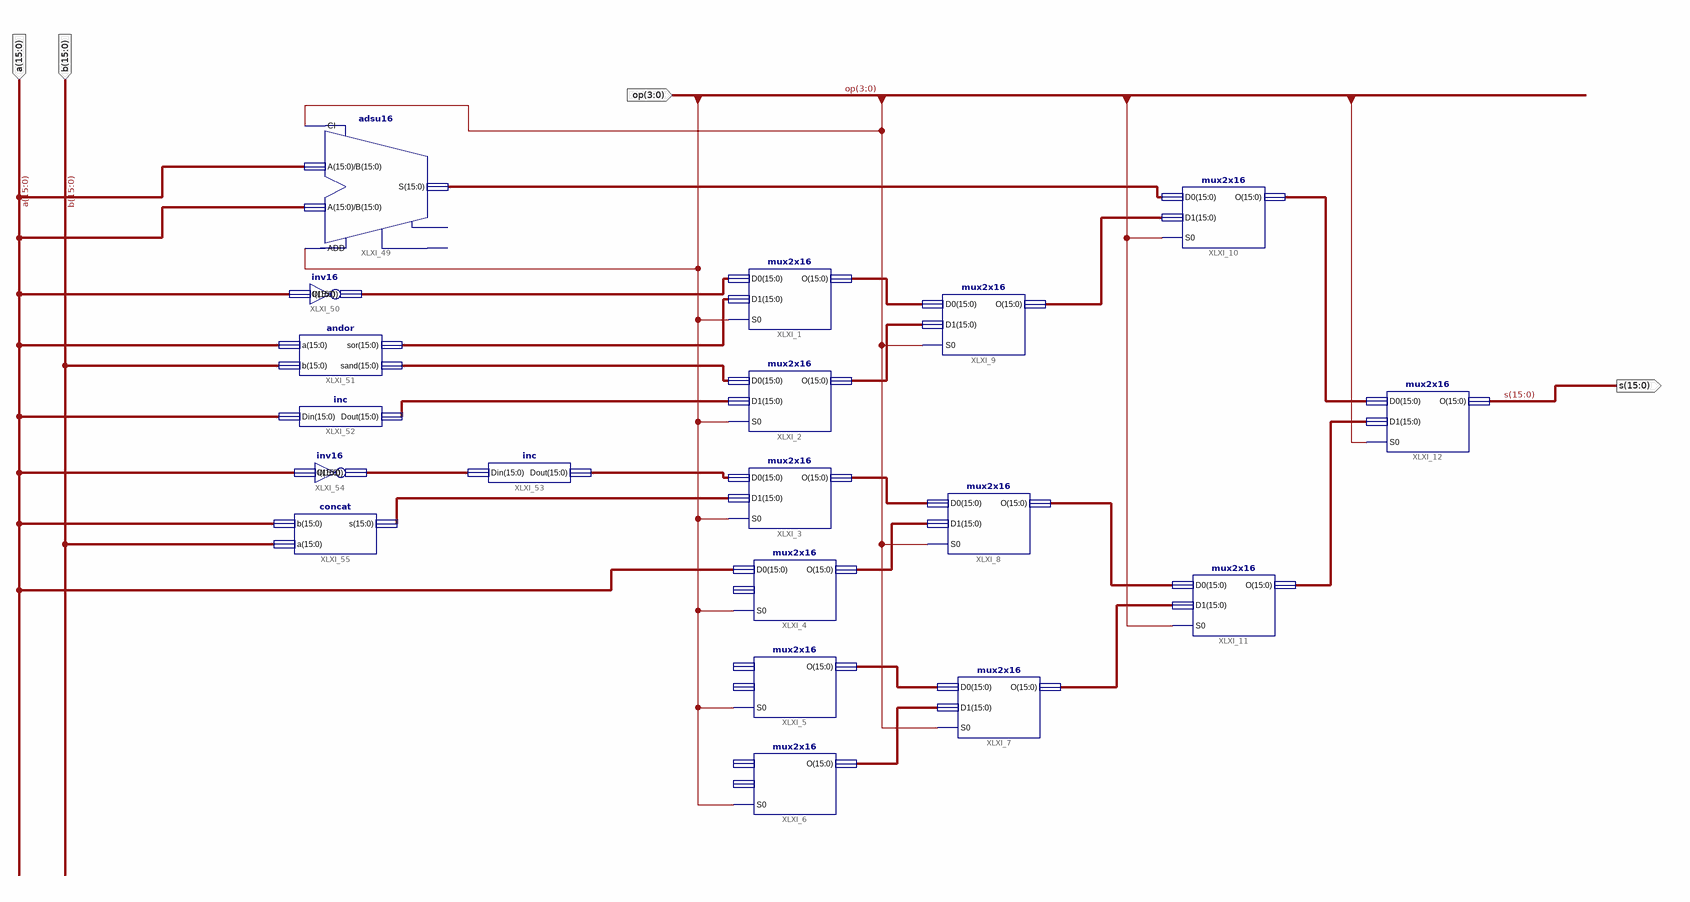
[diagram p0: schematic sheet 1]
// Xilinx ISE schematic ALU.sch (spartan3e) as structural Verilog: 19 symbols, 4 ports
module ALU (
  input  [3:0] op,
  input  [15:0] a,
  input  [15:0] b,
  output [15:0] s
);

  wire XLXN_14, XLXN_16, XLXN_17, XLXN_18;
  wire [15:0] XLXN_2, XLXN_3, XLXN_4, XLXN_5, XLXN_6, XLXN_7, XLXN_8, XLXN_9, XLXN_10, XLXN_11, XLXN_12,
       XLXN_76, XLXN_79, XLXN_80, XLXN_84, XLXN_85, XLXN_87, XLXN_90, XLXN_91;

  mux2x16 XLXI_1 (.D0(XLXN_79), .D1(XLXN_90), .S0(XLXN_14), .O(XLXN_2));
  mux2x16 XLXI_2 (.D0(XLXN_91), .D1(XLXN_80), .S0(XLXN_14), .O(XLXN_3));
  mux2x16 XLXI_3 (.D0(XLXN_87), .D1(XLXN_85), .S0(XLXN_14), .O(XLXN_4));
  mux2x16 XLXI_4 (.D0(a), .S0(XLXN_14), .O(XLXN_5));  // open: D1
  mux2x16 XLXI_5 (.S0(XLXN_14), .O(XLXN_6));  // open: D0, D1
  mux2x16 XLXI_6 (.S0(XLXN_14), .O(XLXN_7));  // open: D0, D1
  mux2x16 XLXI_7 (.D0(XLXN_6), .D1(XLXN_7), .S0(XLXN_16), .O(XLXN_8));
  mux2x16 XLXI_8 (.D0(XLXN_4), .D1(XLXN_5), .S0(XLXN_16), .O(XLXN_9));
  mux2x16 XLXI_9 (.D0(XLXN_2), .D1(XLXN_3), .S0(XLXN_16), .O(XLXN_12));
  mux2x16 XLXI_10 (.D0(XLXN_76), .D1(XLXN_12), .S0(XLXN_17), .O(XLXN_11));
  mux2x16 XLXI_11 (.D0(XLXN_9), .D1(XLXN_8), .S0(XLXN_17), .O(XLXN_10));
  mux2x16 XLXI_12 (.D0(XLXN_11), .D1(XLXN_10), .S0(XLXN_18), .O(s));
  adsu16 XLXI_49 (.A(a), .ADD(XLXN_14), .B(a), .CI(XLXN_16), .S(XLXN_76));  // open: CO, OFL
  inv16 XLXI_50 (.I(a), .O(XLXN_79));
  andor XLXI_51 (.a(a), .b(b), .sor(XLXN_90), .sand(XLXN_91));
  inc XLXI_52 (.Din(a), .Dout(XLXN_80));
  inc XLXI_53 (.Din(XLXN_84), .Dout(XLXN_87));
  inv16 XLXI_54 (.I(a), .O(XLXN_84));
  concat XLXI_55 (.b(a), .a(b), .s(XLXN_85));
endmodule
